# Altium schematic sheet 1_P1.schdoc
size 307 x 218 mm; Symbol: Drawing-Symbol_A4; Device: Drawing-Symbol_A4; Company: 嘉立创EDA; Version: V1.0; Page Size: A4; @Project Name: parallel_trans; @Page Count: 1; @Update Date: 2025-06-30; @Create Date: 2025-04-26; @Schematic Name: Schematic1; @Page No: 1; @Page Name: P1; @Create Time: 08:08:50; @Update Time: 23:19:04; Width: 1170; Height: 825; Region Start: 1; X Region Count: 6; Y Region Count: 4; Blade Width: 10; Title Block Position: 3; @Board Name: Board1
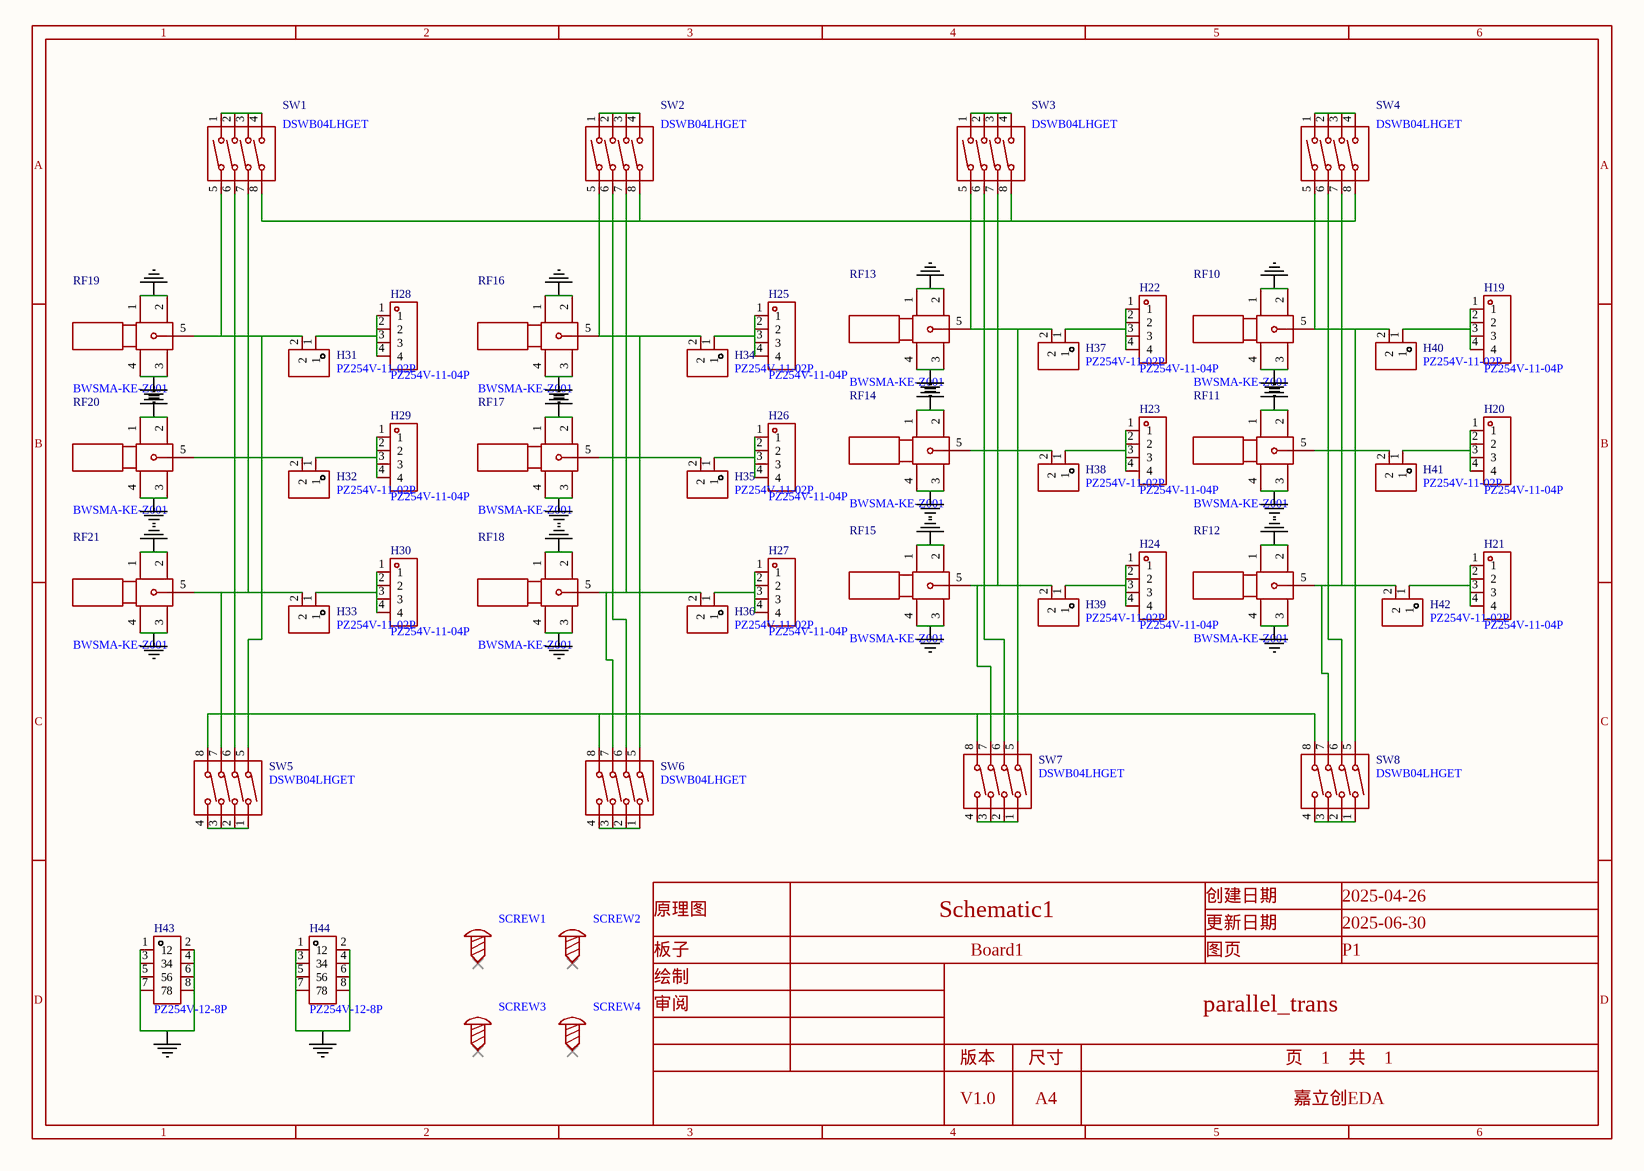
[diagram p0: 1_P1.schdoc]

## Parts
H19  PZ254V-11-04P  [HDR-TH_4P-P2.54-V-M]
H20  PZ254V-11-04P  [HDR-TH_4P-P2.54-V-M]
H21  PZ254V-11-04P  [HDR-TH_4P-P2.54-V-M]
H22  PZ254V-11-04P  [HDR-TH_4P-P2.54-V-M]
H23  PZ254V-11-04P  [HDR-TH_4P-P2.54-V-M]
H24  PZ254V-11-04P  [HDR-TH_4P-P2.54-V-M]
H25  PZ254V-11-04P  [HDR-TH_4P-P2.54-V-M]
H26  PZ254V-11-04P  [HDR-TH_4P-P2.54-V-M]
H27  PZ254V-11-04P  [HDR-TH_4P-P2.54-V-M]
H28  PZ254V-11-04P  [HDR-TH_4P-P2.54-V-M]
H29  PZ254V-11-04P  [HDR-TH_4P-P2.54-V-M]
H30  PZ254V-11-04P  [HDR-TH_4P-P2.54-V-M]
H31  PZ254V-11-02P  [HDR-TH_2P-P2.54-V-M]
H32  PZ254V-11-02P  [HDR-TH_2P-P2.54-V-M]
H33  PZ254V-11-02P  [HDR-TH_2P-P2.54-V-M]
H34  PZ254V-11-02P  [HDR-TH_2P-P2.54-V-M]
H35  PZ254V-11-02P  [HDR-TH_2P-P2.54-V-M]
H36  PZ254V-11-02P  [HDR-TH_2P-P2.54-V-M]
H37  PZ254V-11-02P  [HDR-TH_2P-P2.54-V-M]
H38  PZ254V-11-02P  [HDR-TH_2P-P2.54-V-M]
H39  PZ254V-11-02P  [HDR-TH_2P-P2.54-V-M]
H40  PZ254V-11-02P  [HDR-TH_2P-P2.54-V-M]
H41  PZ254V-11-02P  [HDR-TH_2P-P2.54-V-M]
H42  PZ254V-11-02P  [HDR-TH_2P-P2.54-V-M]
H43  PZ254V-12-8P  [HDR-TH_8P-P2.54-V-M-R2-C4-S2.54]
H44  PZ254V-12-8P  [HDR-TH_8P-P2.54-V-M-R2-C4-S2.54]
RF10  BWSMA-KE-Z001  [SMA-TH_BWSMA-KE-Z001]
RF11  BWSMA-KE-Z001  [SMA-TH_BWSMA-KE-Z001]
RF12  BWSMA-KE-Z001  [SMA-TH_BWSMA-KE-Z001]
RF13  BWSMA-KE-Z001  [SMA-TH_BWSMA-KE-Z001]
RF14  BWSMA-KE-Z001  [SMA-TH_BWSMA-KE-Z001]
RF15  BWSMA-KE-Z001  [SMA-TH_BWSMA-KE-Z001]
RF16  BWSMA-KE-Z001  [SMA-TH_BWSMA-KE-Z001]
RF17  BWSMA-KE-Z001  [SMA-TH_BWSMA-KE-Z001]
RF18  BWSMA-KE-Z001  [SMA-TH_BWSMA-KE-Z001]
RF19  BWSMA-KE-Z001  [SMA-TH_BWSMA-KE-Z001]
RF20  BWSMA-KE-Z001  [SMA-TH_BWSMA-KE-Z001]
RF21  BWSMA-KE-Z001  [SMA-TH_BWSMA-KE-Z001]
SCREW1  (no value)  [M3螺丝]
SCREW2  (no value)  [M3螺丝]
SCREW3  (no value)  [M3螺丝]
SCREW4  (no value)  [M3螺丝]
SW1  DSWB04LHGET  [SW-TH_DSWB04LHGET]
SW2  DSWB04LHGET  [SW-TH_DSWB04LHGET]
SW3  DSWB04LHGET  [SW-TH_DSWB04LHGET]
SW4  DSWB04LHGET  [SW-TH_DSWB04LHGET]
SW5  DSWB04LHGET  [SW-TH_DSWB04LHGET]
SW6  DSWB04LHGET  [SW-TH_DSWB04LHGET]
SW7  DSWB04LHGET  [SW-TH_DSWB04LHGET]
SW8  DSWB04LHGET  [SW-TH_DSWB04LHGET]

## Nets
GND: H43.1 H43.2 H43.3 H43.4 H43.5 H43.6 H43.7 H43.8 H44.1 H44.2 H44.3 H44.4 H44.5 H44.6 H44.7 H44.8 RF10.1 RF10.2 RF10.3 RF10.4 RF11.1 RF11.2 RF11.3 RF11.4 RF12.1 RF12.2 RF12.3 RF12.4 RF13.1 RF13.2 RF13.3 RF13.4 RF14.1 RF14.2 RF14.3 RF14.4 RF15.1 RF15.2 RF15.3 RF15.4 RF16.1 RF16.2 RF16.3 RF16.4 RF17.1 RF17.2 RF17.3 RF17.4 RF18.1 RF18.2 RF18.3 RF18.4 RF19.1 RF19.2 RF19.3 RF19.4 RF20.1 RF20.2 RF20.3 RF20.4 RF21.1 RF21.2 RF21.3 RF21.4
NetH19_1: H19.1 H19.2 H19.3 H19.4 H40.1
NetH20_1: H20.1 H20.2 H20.3 H20.4 H41.1
NetH21_1: H21.1 H21.2 H21.3 H21.4 H42.1
NetH22_1: H22.1 H22.2 H22.3 H22.4 H37.1
NetH23_1: H23.1 H23.2 H23.3 H23.4 H38.1
NetH24_1: H24.1 H24.2 H24.3 H24.4 H39.1
NetH25_1: H25.1 H25.2 H25.3 H25.4 H34.1
NetH26_1: H26.1 H26.2 H26.3 H26.4 H35.1
NetH27_1: H27.1 H27.2 H27.3 H27.4 H36.1
NetH28_1: H28.1 H28.2 H28.3 H28.4 H31.1
NetH29_1: H29.1 H29.2 H29.3 H29.4 H32.1
NetH30_1: H30.1 H30.2 H30.3 H30.4 H33.1
NetH31_2: H31.2 RF19.5 SW1.5 SW5.5
NetH32_2: H32.2 RF20.5 SW1.6 SW5.6
NetH33_2: H33.2 RF21.5 SW1.7 SW5.7
NetH34_2: H34.2 RF16.5 SW2.5 SW6.5
NetH35_2: H35.2 RF17.5 SW2.6 SW6.6
NetH36_2: H36.2 RF18.5 SW2.7 SW6.7
NetH37_2: H37.2 RF13.5 SW3.5 SW7.5
NetH38_2: H38.2 RF14.5 SW3.6 SW7.6
NetH39_2: H39.2 RF15.5 SW3.7 SW7.7
NetH40_2: H40.2 RF10.5 SW4.5 SW8.5
NetH41_2: H41.2 RF11.5 SW4.6 SW8.6
NetH42_2: H42.2 RF12.5 SW4.7 SW8.7
NetSW1_1: SW1.1 SW1.2 SW1.3 SW1.4
NetSW1_8: SW1.8 SW2.8 SW3.8 SW4.8
NetSW2_1: SW2.1 SW2.2 SW2.3 SW2.4
NetSW3_1: SW3.1 SW3.2 SW3.3 SW3.4
NetSW4_1: SW4.1 SW4.2 SW4.3 SW4.4
NetSW5_1: SW5.1 SW5.2 SW5.3 SW5.4
NetSW5_8: SW5.8 SW6.8 SW7.8 SW8.8
NetSW6_1: SW6.1 SW6.2 SW6.3 SW6.4
NetSW7_1: SW7.1 SW7.2 SW7.3 SW7.4
NetSW8_1: SW8.1 SW8.2 SW8.3 SW8.4

Not connected (* = marked no-connect by the designer): SCREW1 1*; SCREW2 1*; SCREW3 1*; SCREW4 1*

## Notes on the sheet
- 1
- 2
- 3
- 4
- 5
- 6
- A
- B
- C
- 原理图
- Schematic1
- 创建日期
- 更新日期
- 2025-04-26
- 2025-06-30
- 板子
- 绘制
- Board1
- 图页
- P1
- D
- 审阅
- 版本
- 尺寸
- parallel_trans
- 页    1    共    1
- V1.0
- A4
- 嘉立创EDA

## Library data of the parts
H19-H30 = PZ254V-11-04P: Manufacturer: XFCN(兴飞); Symbol: PZ254V-11-04P_C2691448; Add into BOM: yes; Pin Structure: 1x4P; Pitch: 2.54mm; Circluar Pins/Square Pins: 方针; Current Rating (Max): 3A; Voltage Rating (Max): 250V; Device: PZ254V-11-04P; LCSC Part Name: 间距:2.54mm 1x4P 直插 方针; Supplier Part: C2691448; Manufacturer Part: PZ254V-11-04P; Supplier Footprint: 插件,P=2.54mm; JLCPCB Part Class: 扩展库; Datasheet: https://atta.szlcsc.com/upload/public/pdf/source/20200309/C492403_F9F19131791D08044AD4F84F8E751A34.pdf; Supplier: LCSC; Convert to PCB: yes; Row Spacing: -; Mounting Type: 直插; Number of Rows: 单排; Number of Pins: 4P; Length of Mating Pin: 6mm; Insulation Height: 2.5mm; Length of End Connection Pin: 3mm; Contact Material: -; Operating Temperature Range: -40℃~+105℃; Color: 黑色
H31-H42 = PZ254V-11-02P: Manufacturer: XFCN(兴飞); Add into BOM: yes; Pin Structure: 1x2P; Pitch: 2.54mm; Circluar Pins/Square Pins: 方针; Symbol: PZ254V-11-02P; Device: PZ254V-11-02P; LCSC Part Name: 1x2P 间距:2.54mm 方针 直插; Supplier Part: C492401; Manufacturer Part: PZ254V-11-02P; Supplier Footprint: 插件,P=2.54mm; JLCPCB Part Class: 扩展库; Datasheet: https://atta.szlcsc.com/upload/public/pdf/source/20200309/C492401_A812433581A9B211A7FFA413ADDFF0E5.pdf; Supplier: LCSC; Convert to PCB: yes; Row Spacing: -; Mounting Type: 直插; Number of Rows: 单排; Number of Pins: 2P; Current Rating: -; Voltage Rating (Max): -; Length of Mating Pin: 6mm; Insulation Height: 2.5mm; Length of End Connection Pin: 3mm; Contact Material: 黄铜; Contact Plating: -; Operating Temperature: -40℃~+105℃; Color: 黑色
H43 H44 = PZ254V-12-8P: Manufacturer: XFCN(兴飞); Add into BOM: yes; Pin Structure: 2x4P; Pitch: 2.54mm; Circluar Pins/Square Pins: 方针; Symbol: PZ254V-12-8P; Device: PZ254V-12-8P; LCSC Part Name: 2x4P 间距:2.54mm 方针 直插; Supplier Part: C492421; Manufacturer Part: PZ254V-12-8P; Supplier Footprint: 插件,P=2.54mm; JLCPCB Part Class: 扩展库; Datasheet: https://atta.szlcsc.com/upload/public/pdf/source/20200309/C492421_DC8A206AF99CD7755BD4A5B0BC48200B.pdf; Supplier: LCSC; Convert to PCB: yes; Row Spacing: 2.54mm; Mounting Type: 直插; Number of Rows: 双排; Number of Pins: 8P; Current Rating: -; Voltage Rating (Max): -; Length of Mating Pin: 6mm; Insulation Height: 2.5mm; Length of End Connection Pin: 3mm; Contact Material: 黄铜; Contact Plating: -; Operating Temperature: -40℃~+105℃; Color: 黑色
RF10-RF21 = BWSMA-KE-Z001_C496549: Manufacturer: BAT WIRELESS(蝙蝠无线); Add into BOM: yes; Connector Type: 板端; Interface Type: 内孔; Number of Ports: 1; RF Series: SMA; Impedance: 50Ω; Style: 正脚; Symbol: BWSMA-KE-Z001; Device: BWSMA-KE-Z001_C496549; LCSC Part Name: 内孔 SMA 正脚; Supplier Part: C496549; Manufacturer Part: BWSMA-KE-Z001; Supplier Footprint: 插件; JLCPCB Part Class: 扩展库; Datasheet: https://atta.szlcsc.com/upload/public/pdf/source/20221228/40BF41E56A06003A0210E1785CA66EA6.pdf; Supplier: LCSC; Convert to PCB: yes; Interface Diameter: -; Interface Length/Height: -; Frequency-Max: -; Contact Material: -; Contact Plating: -; Operating Temperature Range: -65℃~+165℃; Soldering Temperature(Max): -
SCREW1-SCREW4 = M3螺丝: Symbol: 螺丝孔; Convert to PCB: yes; Device: M3螺丝; Add into BOM: yes; Supplier Footprint: 插件
SW1-SW8 = DSWB04LHGET: Manufacturer: YE; Add into BOM: yes; Circuit: 单刀单掷; Number of Positions: 4位; Symbol: DSWB04LHGET; Device: DSWB04LHGET; LCSC Part Name: 间距2.54mm 平拨,凸起式 4位拨码开关; Supplier Part: C99418; Manufacturer Part: DSWB04LHGET; Supplier Footprint: 插件; JLCPCB Part Class: 扩展库; Datasheet: https://atta.szlcsc.com/upload/public/pdf/source/20220830/02827E67A8727938D957A3CE4C86C92D.pdf; Supplier: LCSC; Convert to PCB: yes; Type: 平拨,凸起式; Lead Pitch: 2.54mm; Operating Life: -; Color: 红色